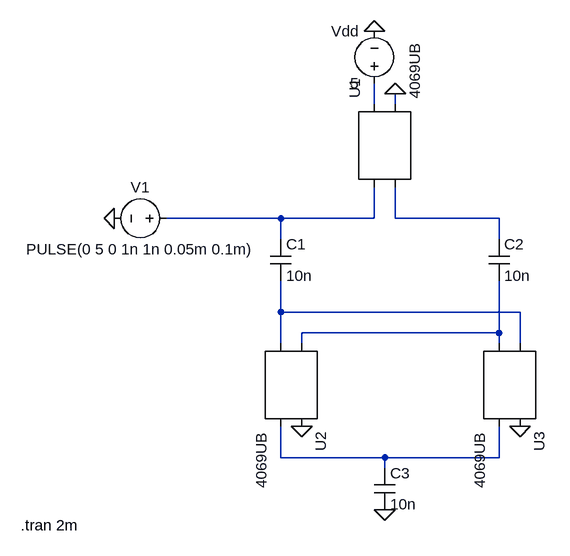
[diagram p0: schematic Q2.asc]
Q2.asc, the LTspice schematic file:
Version 4
SHEET 1 880 680
WIRE 192 -80 192 -112
WIRE 224 -80 224 -96
WIRE 48 96 -128 96
WIRE 192 96 192 48
WIRE 192 96 48 96
WIRE 224 96 224 48
WIRE 384 96 224 96
WIRE 48 128 48 96
WIRE 384 128 384 96
WIRE 48 240 48 192
WIRE 416 240 48 240
WIRE 384 272 384 192
WIRE 384 272 80 272
WIRE 48 288 48 240
WIRE 80 288 80 272
WIRE 384 288 384 272
WIRE 416 288 416 240
WIRE 48 464 48 416
WIRE 208 464 48 464
WIRE 384 464 384 416
WIRE 384 464 208 464
WIRE 208 480 208 464
FLAG 224 -96 0
FLAG -208 96 0
FLAG 192 -192 0
FLAG 208 544 0
FLAG 80 416 0
FLAG 416 416 0
SYMBOL AutoGenerated\\4069UB 208 -16 R270
SYMATTR InstName U1
SYMBOL AutoGenerated\\4069UB 64 352 R90
SYMATTR InstName U2
SYMBOL AutoGenerated\\4069UB 400 352 R90
SYMATTR InstName U3
SYMBOL voltage -112 96 R90
WINDOW 0 -32 56 VBottom 2
WINDOW 3 32 56 VTop 2
WINDOW 123 0 0 Left 0
WINDOW 39 0 0 Left 0
SYMATTR InstName V1
SYMATTR Value PULSE(0 5 0 1n 1n 0.05m 0.1m)
SYMBOL voltage 192 -96 R180
WINDOW 0 24 96 Left 2
WINDOW 3 24 16 Left 2
SYMATTR InstName Vdd
SYMATTR Value 5
SYMBOL cap 32 128 R0
SYMATTR InstName C1
SYMATTR Value 10n
SYMBOL cap 368 128 R0
SYMATTR InstName C2
SYMATTR Value 10n
SYMBOL cap 192 480 R0
SYMATTR InstName C3
SYMATTR Value 10n
TEXT -352 568 Left 2 !.tran 2m

The netlist it stands for:
* Q2.asc
* U1: 4069UB (symbol AutoGenerated\4069UB not available, pins judged from their places): pin1=N002 pin2=N003 pin3=N001 pin4=0
* U2: 4069UB (symbol AutoGenerated\4069UB not available, pins judged from their places): pin1=N005 pin2=N004 pin3=0 pin4=N006
* U3: 4069UB (symbol AutoGenerated\4069UB not available, pins judged from their places): pin1=N004 pin2=N005 pin3=0 pin4=N006
V1 N002 0 PULSE(0 5 0 1n 1n 0.05m 0.1m)
Vdd N001 0 5
C1 N002 N004 10n
C2 N003 N005 10n
C3 N006 0 10n
.tran 2m
.backanno
.end